# EAGLE schematic Shruthi-Digital-XT-v01 (EAGLE 5.09)

## Sheet 1 of 3
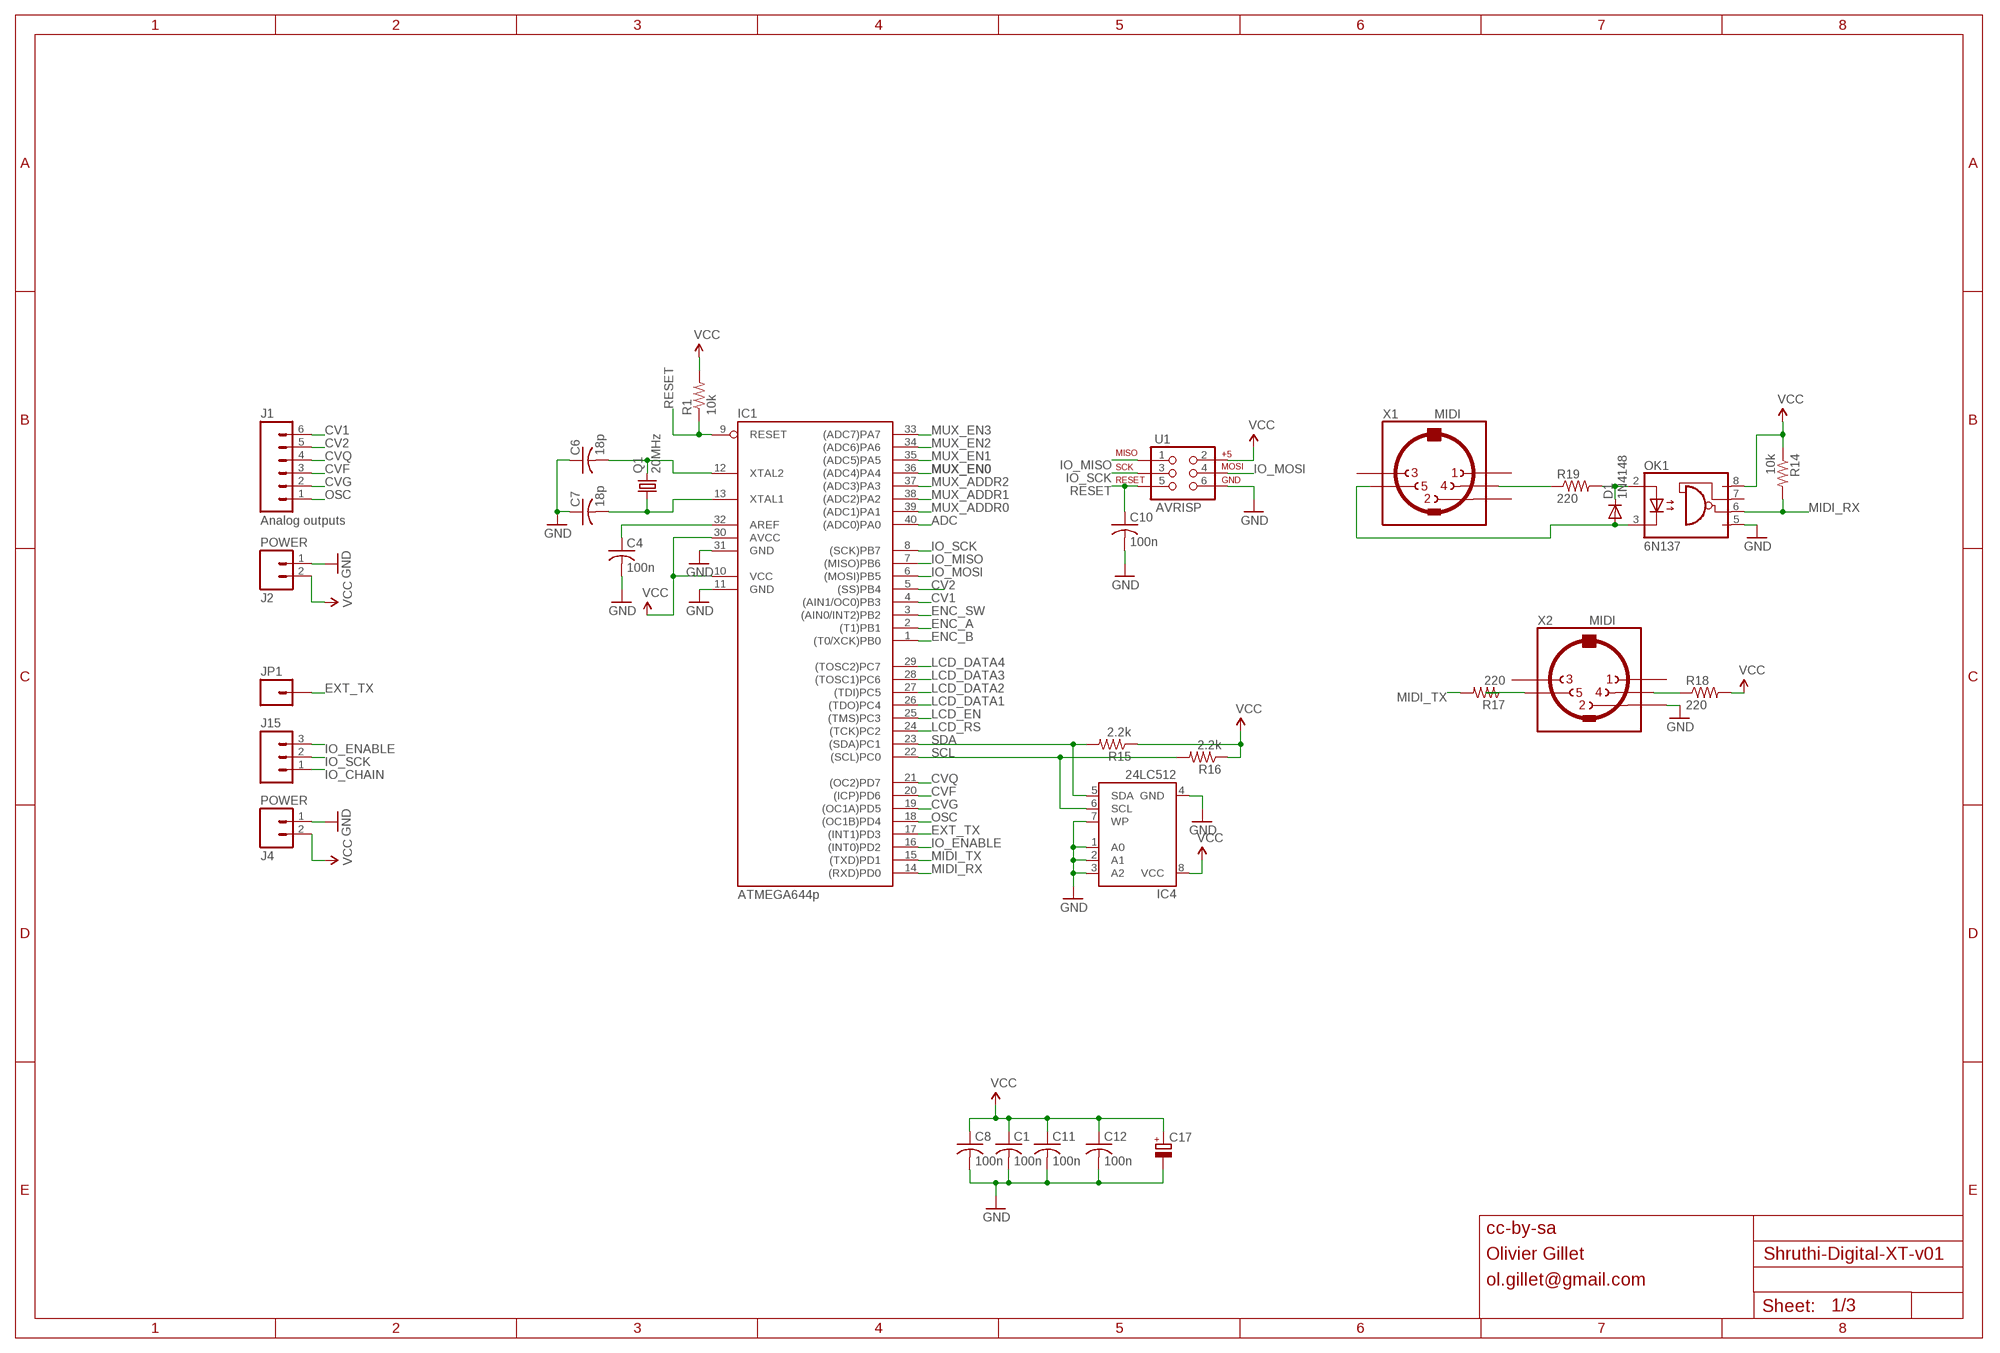
[diagram p0: schematic, sheet 1]

### Parts
C1  100n  C-US025-024X044  [C025-024X044]
C4  100n  C-US025-024X044  [C025-024X044]
C6  18p  C-US025-024X044  [C025-024X044]
C7  18p  C-US025-024X044  [C025-024X044]
C8  100n  C-US025-024X044  [C025-024X044]
C10  100n  C-US025-024X044  [C025-024X044]
C11  100n  C-US025-024X044  [C025-024X044]
C12  100n  C-US025-024X044  [C025-024X044]
C17  CPOL-EUE2.5-7  [E2,5-7]
D1  1N4148  DIODE-D-5  [D-5]
IC1  ATMEGA644p  MEGA16-P  [DIL40]
IC4  24LC512  AT24CP  [DIL08]
J1  M06SIP  [1X06]
J2  POWER  M02PTH  [1X02]
J4  POWER  M02PTH  [1X02]
J15  M03PTH  [1X03]
JP1  M01PTH  [1X01]
OK1  6N137  [DIL08]
Q1  20MHz  CRYSTALHC49U-V  [HC49U-V]
R1  10k  R-US_0204/7  [0204/7]
R14  10k  R-US_0204/7  [0204/7]
R15  2.2k  R-US_0204/7  [0204/7]
R16  2.2k  R-US_0204/7  [0204/7]
R17  220  R-US_0204/7  [0204/7]
R18  220  R-US_0204/7  [0204/7]
R19  220  R-US_0204/7  [0204/7]
U1  AVRISP  AVR_SPI_PRG_6PTH  [2X3]
X1  MIDI  MAB5SH  [MAB5SH]
X2  MIDI  MAB5SH  [MAB5SH]

### Nets
ADC: IC1.40((ADC0)PA0) ; also sheet 2
CV1: IC1.4((AIN1/OC0)PB3) J1.6
CV2: IC1.5((SS)PB4) J1.5
CVF: IC1.20((ICP)PD6) J1.3
CVG: IC1.19((OC1A)PD5) J1.2
CVQ: IC1.21((OC2)PD7) J1.4
ENC_A: IC1.2((T1)PB1) ; also sheet 3
ENC_B: IC1.1((T0/XCK)PB0) ; also sheet 3
ENC_SW: IC1.3((AIN0/INT2)PB2) ; also sheet 3
EXT_TX: IC1.17((INT1)PD3) JP1.1
GND: C1.2 C4.2 C6.1 C7.1 C8.2 C10.2 C11.2 C12.2 C17.- IC1.11(GND) IC1.31(GND) IC4.1(A0) IC4.2(A1) IC4.3(A2) IC4.4(GND) IC4.7(WP) J2.1 J4.1 OK1.5(GND) U1.6 X2.2 ; also sheet 2,3
IO_CHAIN: J15.1 ; also sheet 3
IO_ENABLE: IC1.16((INT0)PD2) J15.3 ; also sheet 3
IO_MISO: IC1.7((MISO)PB6) U1.1 ; also sheet 3
IO_MOSI: IC1.6((MOSI)PB5) U1.4 ; also sheet 3
IO_SCK: IC1.8((SCK)PB7) J15.2 U1.3 ; also sheet 3
LCD_DATA1: IC1.26((TDO)PC4) ; also sheet 3
LCD_DATA2: IC1.27((TDI)PC5) ; also sheet 3
LCD_DATA3: IC1.28((TOSC1)PC6) ; also sheet 3
LCD_DATA4: IC1.29((TOSC2)PC7) ; also sheet 3
LCD_EN: IC1.25((TMS)PC3) ; also sheet 3
LCD_RS: IC1.24((TCK)PC2) ; also sheet 3
MIDI_RX: IC1.14((RXD)PD0) OK1.6(VO) R14.2
MIDI_TX: IC1.15((TXD)PD1) R17.2
MUX_ADDR0: IC1.39((ADC1)PA1) ; also sheet 2
MUX_ADDR1: IC1.38((ADC2)PA2) ; also sheet 2
MUX_ADDR2: IC1.37((ADC3)PA3) ; also sheet 2
MUX_EN0: IC1.36((ADC4)PA4) ; also sheet 2
MUX_EN1: IC1.35((ADC5)PA5) ; also sheet 2
MUX_EN2: IC1.34((ADC6)PA6) ; also sheet 2
MUX_EN3: IC1.33((ADC7)PA7) ; also sheet 2
N$2: R17.1 X2.5
N$7: C4.1 IC1.32(AREF)
N$28: D1.C OK1.2(A) R19.2
N$68: R18.1 X2.4
N$72: R19.1 X1.4
N$73: D1.A OK1.3(C) X1.5
N$82: C7.2 IC1.13(XTAL1) Q1.1
N$83: C6.2 IC1.12(XTAL2) Q1.2
OSC: IC1.18((OC1B)PD4) J1.1
RESET: C10.1 IC1.9(RESET) R1.1 U1.5
SCL: IC1.22((SCL)PC0) IC4.6(SCL) R16.2
SDA: IC1.23((SDA)PC1) IC4.5(SDA) R15.2
VCC: C1.1 C8.1 C11.1 C12.1 C17.+ IC1.10(VCC) IC1.30(AVCC) IC4.8(VCC) J2.2 J4.2 OK1.8(VCC) R1.2 R14.1 R15.1 R16.1 R18.2 U1.2 ; also sheet 2,3
Unconnected: OK1.7(VE) X1.1 X1.2 X1.3 X2.1 X2.3

### Notes on the sheet
- Analog outputs
- cc-by-sa
- Olivier Gillet
- ol.gillet@gmail.com

## Sheet 2 of 3
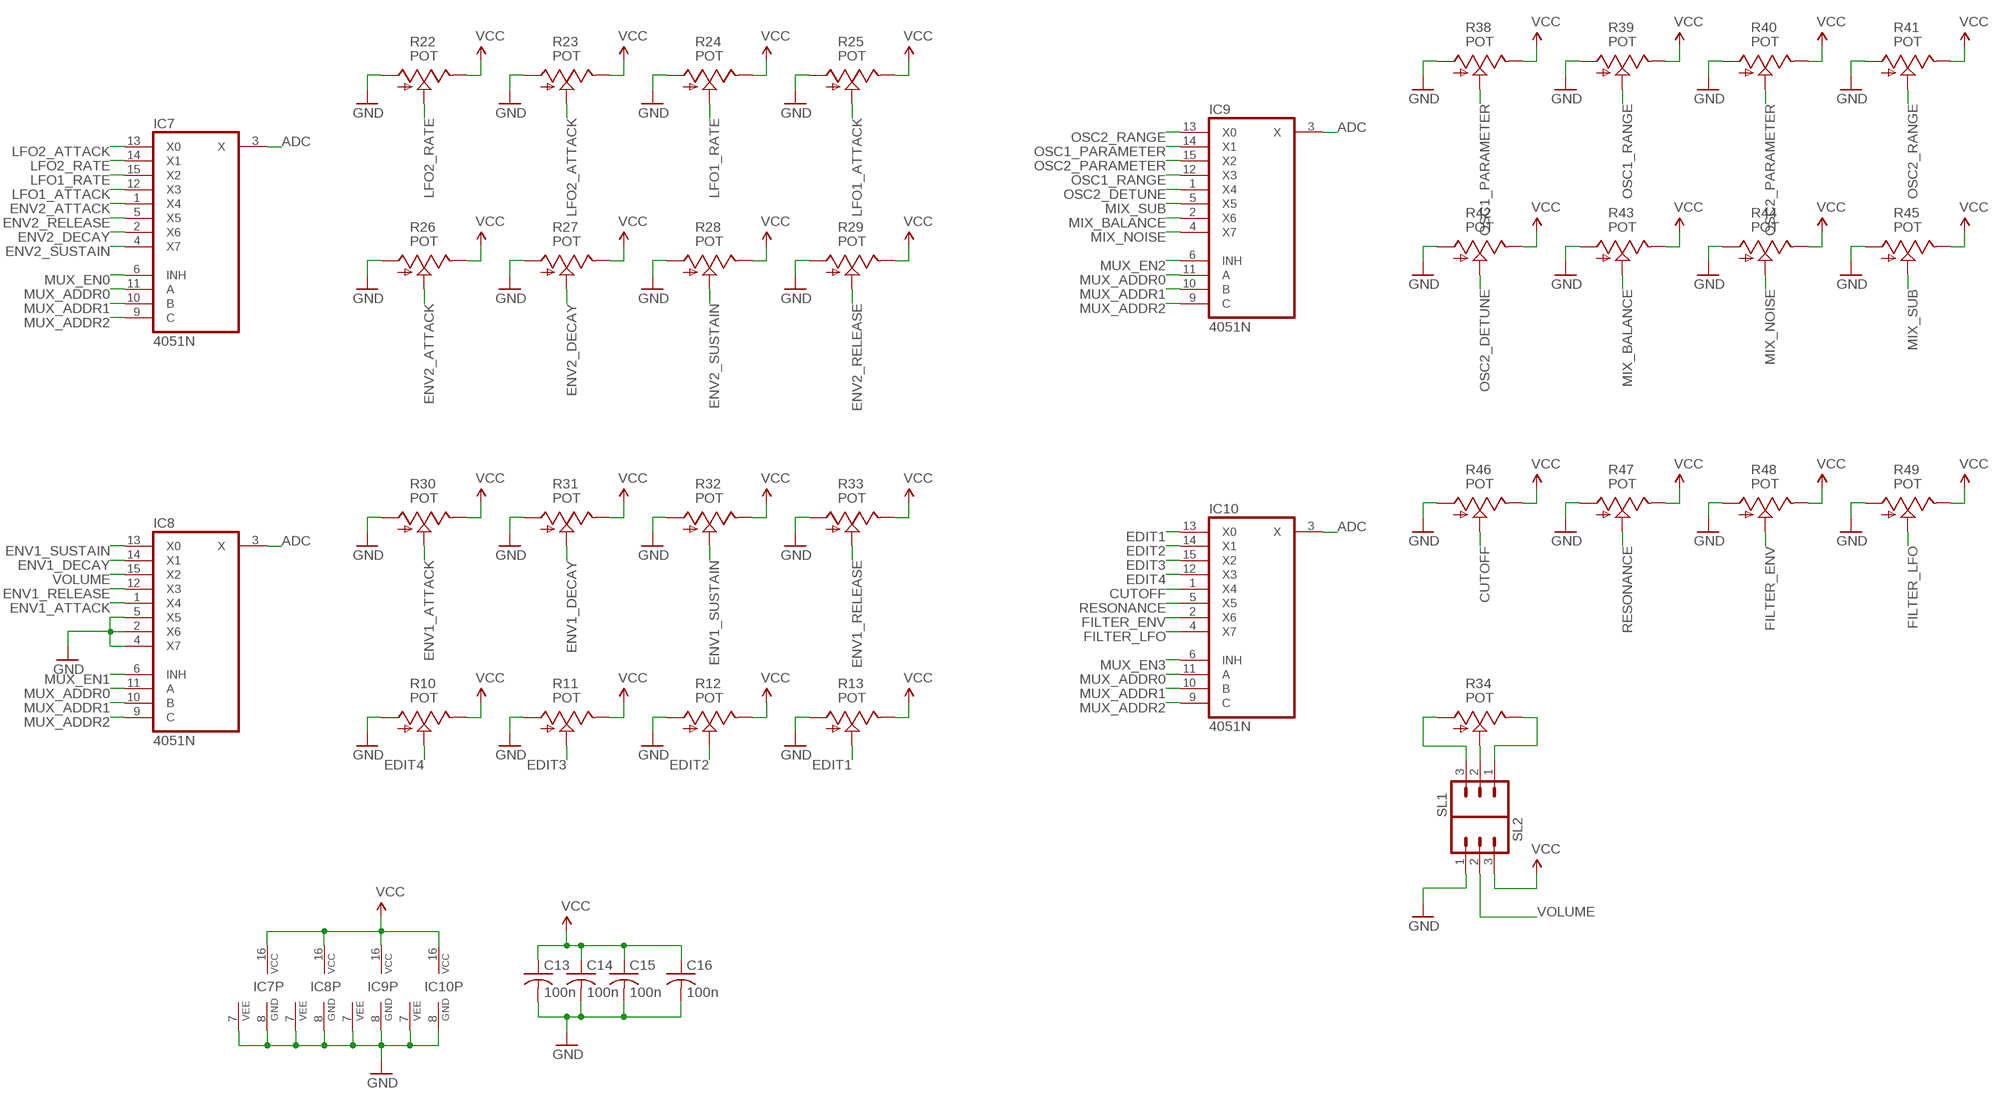
[diagram p1: schematic, sheet 2]

### Parts
C13  100n  C-US025-024X044  [C025-024X044]
C14  100n  C-US025-024X044  [C025-024X044]
C15  100n  C-US025-024X044  [C025-024X044]
C16  100n  C-US025-024X044  [C025-024X044]
IC7  4051N  [DIL16]
IC8  4051N  [DIL16]
IC9  4051N  [DIL16]
IC10  4051N  [DIL16]
R10  POT  POT_USVERTICAL  [ALPS_POT_VERTICAL]
R11  POT  POT_USVERTICAL  [ALPS_POT_VERTICAL]
R12  POT  POT_USVERTICAL  [ALPS_POT_VERTICAL]
R13  POT  POT_USVERTICAL  [ALPS_POT_VERTICAL]
R22  POT  POT_USVERTICAL  [ALPS_POT_VERTICAL]
R23  POT  POT_USVERTICAL  [ALPS_POT_VERTICAL]
R24  POT  POT_USVERTICAL  [ALPS_POT_VERTICAL]
R25  POT  POT_USVERTICAL  [ALPS_POT_VERTICAL]
R26  POT  POT_USVERTICAL  [ALPS_POT_VERTICAL]
R27  POT  POT_USVERTICAL  [ALPS_POT_VERTICAL]
R28  POT  POT_USVERTICAL  [ALPS_POT_VERTICAL]
R29  POT  POT_USVERTICAL  [ALPS_POT_VERTICAL]
R30  POT  POT_USVERTICAL  [ALPS_POT_VERTICAL]
R31  POT  POT_USVERTICAL  [ALPS_POT_VERTICAL]
R32  POT  POT_USVERTICAL  [ALPS_POT_VERTICAL]
R33  POT  POT_USVERTICAL  [ALPS_POT_VERTICAL]
R34  POT  POT_USVERTICAL  [ALPS_POT_VERTICAL]
R38  POT  POT_USVERTICAL  [ALPS_POT_VERTICAL]
R39  POT  POT_USVERTICAL  [ALPS_POT_VERTICAL]
R40  POT  POT_USVERTICAL  [ALPS_POT_VERTICAL]
R41  POT  POT_USVERTICAL  [ALPS_POT_VERTICAL]
R42  POT  POT_USVERTICAL  [ALPS_POT_VERTICAL]
R43  POT  POT_USVERTICAL  [ALPS_POT_VERTICAL]
R44  POT  POT_USVERTICAL  [ALPS_POT_VERTICAL]
R45  POT  POT_USVERTICAL  [ALPS_POT_VERTICAL]
R46  POT  POT_USVERTICAL  [ALPS_POT_VERTICAL]
R47  POT  POT_USVERTICAL  [ALPS_POT_VERTICAL]
R48  POT  POT_USVERTICAL  [ALPS_POT_VERTICAL]
R49  POT  POT_USVERTICAL  [ALPS_POT_VERTICAL]
SL1  M03PTH  [1X03]
SL2  M03PTH  [1X03]

### Nets
ADC: IC7.3(X) IC8.3(X) IC9.3(X) IC10.3(X) ; also sheet 1
CUTOFF: IC10.1(X4) R46.P$2(S)
EDIT1: IC10.13(X0) R13.P$2(S)
EDIT2: IC10.14(X1) R12.P$2(S)
EDIT3: IC10.15(X2) R11.P$2(S)
EDIT4: IC10.12(X3) R10.P$2(S)
ENV1_ATTACK: IC8.1(X4) R30.P$2(S)
ENV1_DECAY: IC8.14(X1) R31.P$2(S)
ENV1_RELEASE: IC8.12(X3) R33.P$2(S)
ENV1_SUSTAIN: IC8.13(X0) R32.P$2(S)
ENV2_ATTACK: IC7.1(X4) R26.P$2(S)
ENV2_DECAY: IC7.2(X6) R27.P$2(S)
ENV2_RELEASE: IC7.5(X5) R29.P$2(S)
ENV2_SUSTAIN: IC7.4(X7) R28.P$2(S)
FILTER_ENV: IC10.2(X6) R48.P$2(S)
FILTER_LFO: IC10.4(X7) R49.P$2(S)
GND: C13.2 C14.2 C15.2 C16.2 IC7.7(VEE) IC7.8(GND) IC8.2(X6) IC8.4(X7) IC8.5(X5) IC8.7(VEE) IC8.8(GND) IC9.7(VEE) IC9.8(GND) IC10.7(VEE) IC10.8(GND) R10.P$3(A) R11.P$3(A) R12.P$3(A) R13.P$3(A) R22.P$3(A) R23.P$3(A) R24.P$3(A) R25.P$3(A) R26.P$3(A) R27.P$3(A) R28.P$3(A) R29.P$3(A) R30.P$3(A) R31.P$3(A) R32.P$3(A) R33.P$3(A) R38.P$3(A) R39.P$3(A) R40.P$3(A) R41.P$3(A) R42.P$3(A) R43.P$3(A) R44.P$3(A) R45.P$3(A) R46.P$3(A) R47.P$3(A) R48.P$3(A) R49.P$3(A) SL2.1 ; also sheet 1,3
LFO1_ATTACK: IC7.12(X3) R25.P$2(S)
LFO1_RATE: IC7.15(X2) R24.P$2(S)
LFO2_ATTACK: IC7.13(X0) R23.P$2(S)
LFO2_RATE: IC7.14(X1) R22.P$2(S)
MIX_BALANCE: IC9.2(X6) R43.P$2(S)
MIX_NOISE: IC9.4(X7) R44.P$2(S)
MIX_SUB: IC9.5(X5) R45.P$2(S)
MUX_ADDR0: IC7.11(A) IC8.11(A) IC9.11(A) IC10.11(A) ; also sheet 1
MUX_ADDR1: IC7.10(B) IC8.10(B) IC9.10(B) IC10.10(B) ; also sheet 1
MUX_ADDR2: IC7.9(C) IC8.9(C) IC9.9(C) IC10.9(C) ; also sheet 1
MUX_EN0: IC7.6(INH) ; also sheet 1
MUX_EN1: IC8.6(INH) ; also sheet 1
MUX_EN2: IC9.6(INH) ; also sheet 1
MUX_EN3: IC10.6(INH) ; also sheet 1
N$6: R34.P$3(A) SL1.3
N$8: R34.P$1(E) SL1.1
N$14: R34.P$2(S) SL1.2
OSC1_PARAMETER: IC9.14(X1) R38.P$2(S)
OSC1_RANGE: IC9.12(X3) R39.P$2(S)
OSC2_DETUNE: IC9.1(X4) R42.P$2(S)
OSC2_PARAMETER: IC9.15(X2) R40.P$2(S)
OSC2_RANGE: IC9.13(X0) R41.P$2(S)
RESONANCE: IC10.5(X5) R47.P$2(S)
VCC: C13.1 C14.1 C15.1 C16.1 IC7.16(VCC) IC8.16(VCC) IC9.16(VCC) IC10.16(VCC) R10.P$1(E) R11.P$1(E) R12.P$1(E) R13.P$1(E) R22.P$1(E) R23.P$1(E) R24.P$1(E) R25.P$1(E) R26.P$1(E) R27.P$1(E) R28.P$1(E) R29.P$1(E) R30.P$1(E) R31.P$1(E) R32.P$1(E) R33.P$1(E) R38.P$1(E) R39.P$1(E) R40.P$1(E) R41.P$1(E) R42.P$1(E) R43.P$1(E) R44.P$1(E) R45.P$1(E) R46.P$1(E) R47.P$1(E) R48.P$1(E) R49.P$1(E) SL2.3 ; also sheet 1,3
VOLUME: IC8.15(X2) SL2.2

## Sheet 3 of 3
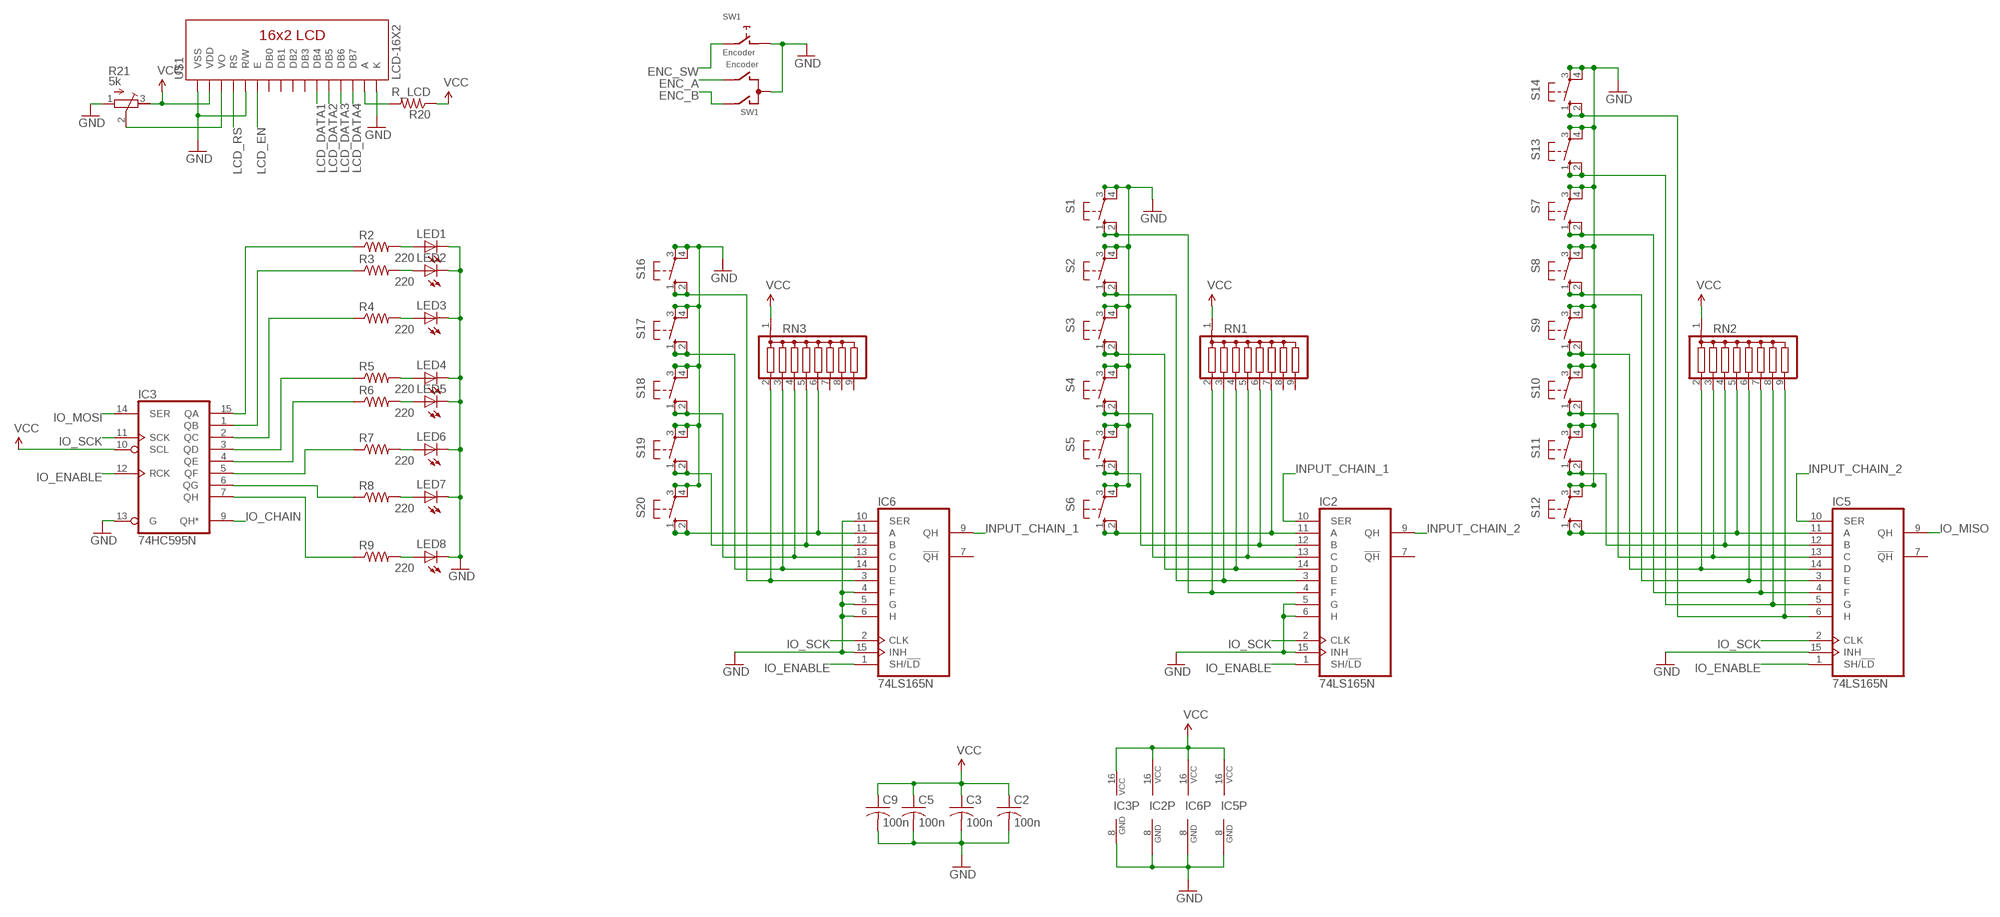
[diagram p2: schematic, sheet 3]

### Parts
C2  100n  C-US025-024X044  [C025-024X044]
C3  100n  C-US025-024X044  [C025-024X044]
C5  100n  C-US025-024X044  [C025-024X044]
C9  100n  C-US025-024X044  [C025-024X044]
IC2  74LS165N  [DIL16]
IC3  74HC595N  [DIL16]
IC5  74LS165N  [DIL16]
IC6  74LS165N  [DIL16]
LED1  LED3MM  [LED3MM]
LED2  LED3MM  [LED3MM]
LED3  LED3MM  [LED3MM]
LED4  LED3MM  [LED3MM]
LED5  LED3MM  [LED3MM]
LED6  LED3MM  [LED3MM]
LED7  LED3MM  [LED3MM]
LED8  LED3MM  [LED3MM]
R2  220  R-US_0204/7  [0204/7]
R3  220  R-US_0204/7  [0204/7]
R4  220  R-US_0204/7  [0204/7]
R5  220  R-US_0204/7  [0204/7]
R6  220  R-US_0204/7  [0204/7]
R7  220  R-US_0204/7  [0204/7]
R8  220  R-US_0204/7  [0204/7]
R9  220  R-US_0204/7  [0204/7]
R20  R_LCD  R-US_0204/7  [0204/7]
R21  5k  R-TRIMM3339P  [RTRIM3339P]
RN1  G08R  [SIL9]
RN2  G08R  [SIL9]
RN3  G08R  [SIL9]
S1  40-XX  [B3F-40XX]
S2  40-XX  [B3F-40XX]
S3  40-XX  [B3F-40XX]
S4  40-XX  [B3F-40XX]
S5  40-XX  [B3F-40XX]
S6  40-XX  [B3F-40XX]
S7  40-XX  [B3F-40XX]
S8  40-XX  [B3F-40XX]
S9  40-XX  [B3F-40XX]
S10  40-XX  [B3F-40XX]
S11  40-XX  [B3F-40XX]
S12  40-XX  [B3F-40XX]
S13  40-XX  [B3F-40XX]
S14  40-XX  [B3F-40XX]
S16  40-XX  [B3F-40XX]
S17  40-XX  [B3F-40XX]
S18  40-XX  [B3F-40XX]
S19  40-XX  [B3F-40XX]
S20  40-XX  [B3F-40XX]
SW1  Encoder  EC12E_SW  [ALPS_EC12E_SW]
U$1  LCD-16X2  [LCD-16X2]

### Nets
ENC_A: SW1.B ; also sheet 1
ENC_B: SW1.A ; also sheet 1
ENC_SW: SW1.E ; also sheet 1
GND: C2.2 C3.2 C5.2 C9.2 IC2.5(G) IC2.6(H) IC2.8(GND) IC2.15(INH) IC3.8(GND) IC3.13(G) IC5.8(GND) IC5.15(INH) IC6.4(F) IC6.5(G) IC6.6(H) IC6.8(GND) IC6.10(SER) IC6.15(INH) LED1.K(C) LED2.K(C) LED3.K(C) LED4.K(C) LED5.K(C) LED6.K(C) LED7.K(C) LED8.K(C) R21.1(E) S1.3(P) S1.4(P1) S2.3(P) S2.4(P1) S3.3(P) S3.4(P1) S4.3(P) S4.4(P1) S5.3(P) S5.4(P1) S6.3(P) S6.4(P1) S7.3(P) S7.4(P1) S8.3(P) S8.4(P1) S9.3(P) S9.4(P1) S10.3(P) S10.4(P1) S11.3(P) S11.4(P1) S12.3(P) S12.4(P1) S13.3(P) S13.4(P1) S14.3(P) S14.4(P1) S16.3(P) S16.4(P1) S17.3(P) S17.4(P1) S18.3(P) S18.4(P1) S19.3(P) S19.4(P1) S20.3(P) S20.4(P1) SW1.C SW1.D U$1.1(VSS) U$1.5(R/W) U$1.16(K) ; also sheet 1,2
INPUT_CHAIN_1: IC2.10(SER) IC6.9(QH)
INPUT_CHAIN_2: IC2.9(QH) IC5.10(SER)
IO_CHAIN: IC3.9(QH*) ; also sheet 1
IO_ENABLE: IC2.1(SH/!LD) IC3.12(RCK) IC5.1(SH/!LD) IC6.1(SH/!LD) ; also sheet 1
IO_MISO: IC5.9(QH) ; also sheet 1
IO_MOSI: IC3.14(SER) ; also sheet 1
IO_SCK: IC2.2(CLK) IC3.11(SCK) IC5.2(CLK) IC6.2(CLK) ; also sheet 1
LCD_DATA1: U$1.11(DB4) ; also sheet 1
LCD_DATA2: U$1.12(DB5) ; also sheet 1
LCD_DATA3: U$1.13(DB6) ; also sheet 1
LCD_DATA4: U$1.14(DB7) ; also sheet 1
LCD_EN: U$1.6(E) ; also sheet 1
LCD_RS: U$1.4(RS) ; also sheet 1
N$1: IC3.2(QC) R4.1
N$3: IC2.11(A) RN1.7 S6.1(S) S6.2(S1)
N$5: IC2.3(E) RN1.3 S2.1(S) S2.2(S1)
N$9: IC5.4(F) RN2.7 S7.1(S) S7.2(S1)
N$10: IC5.14(D) RN2.2 S9.1(S) S9.2(S1)
N$11: IC5.13(C) RN2.3 S10.1(S) S10.2(S1)
N$12: IC5.12(B) RN2.4 S11.1(S) S11.2(S1)
N$13: IC5.11(A) RN2.5 S12.1(S) S12.2(S1)
N$15: IC5.3(E) RN2.6 S8.1(S) S8.2(S1)
N$17: IC5.5(G) RN2.8 S13.1(S) S13.2(S1)
N$24: IC5.6(H) RN2.9 S14.1(S) S14.2(S1)
N$30: IC3.15(QA) R2.1
N$31: IC3.1(QB) R3.1
N$33: IC3.3(QD) R5.1
N$34: IC3.4(QE) R6.1
N$35: IC3.5(QF) R7.1
N$36: IC3.7(QH) R9.1
N$37: IC3.6(QG) R8.1
N$38: IC6.14(D) RN3.3 S17.1(S) S17.2(S1)
N$39: IC6.13(C) RN3.4 S18.1(S) S18.2(S1)
N$40: IC6.12(B) RN3.5 S19.1(S) S19.2(S1)
N$41: IC6.11(A) RN3.6 S20.1(S) S20.2(S1)
N$42: LED1.A R2.2
N$43: LED2.A R3.2
N$44: LED3.A R4.2
N$45: LED4.A R5.2
N$46: LED5.A R6.2
N$47: LED6.A R7.2
N$48: LED7.A R8.2
N$49: LED8.A R9.2
N$50: IC6.3(E) RN3.2 S16.1(S) S16.2(S1)
N$59: IC2.4(F) RN1.2 S1.1(S) S1.2(S1)
N$61: IC2.14(D) RN1.4 S3.1(S) S3.2(S1)
N$62: IC2.13(C) RN1.5 S4.1(S) S4.2(S1)
N$63: IC2.12(B) RN1.6 S5.1(S) S5.2(S1)
N$78: R21.2(S) U$1.3(VO)
N$79: R20.2 U$1.15(A)
VCC: C2.1 C3.1 C5.1 C9.1 IC2.16(VCC) IC3.10(SCL) IC3.16(VCC) IC5.16(VCC) IC6.16(VCC) R20.1 R21.3(A) RN1.1 RN2.1 RN3.1 U$1.2(VDD) ; also sheet 1,2
Unconnected: IC2.7(!QH) IC5.7(!QH) IC6.7(!QH) RN1.8 RN1.9 RN3.7 RN3.8 RN3.9 SW1.GND1(G) SW1.GND2(G) U$1.7(DB0) U$1.8(DB1) U$1.9(DB2) U$1.10(DB3)

## Library data of the parts
C1-C16 = rcl:C-US: CAPACITOR, American symbol
C17 = rcl:CPOL-EU: POLARIZED CAPACITOR, European symbol
D1 = diode:DIODE-: DIODE
IC1 = atmel:MEGA16-P: MICROCONTROLLER 16 Kbytes FLASH 1 kbytes SRAM 512 bytes EEPROM USART 8-channel 10 bit ADC Source: avr.lbr
IC2 IC5 IC6 = 74xx-us:74*165: 8-bit parallel load SHIFT REGISTER
IC3 = 74xx-eu:74*595: 8-bit SHIFT REGISTER, output latch
IC4 = atmel:AT24C*: 2-wire serial EEPROM
IC7-IC10 = 40xx:4051: 8-channel ANALOG MULTIPLEXER
J1 = SparkFun:M06: Header 6 Standard 6-pin 0.1" header. Use with straight break away headers (SKU : PRT-00116), right angle break away headers (PRT-00553), swiss pins (PRT-00743), machine pins (PRT-00117), and female headers (PRT-00115). Molex polarized connector foot print use with SKU : PRT-08094 with associated crimp pins and housings. NOTES ON THE VARIANTS LOCK and LOCK_LONGPADS... This footprint was designed to help hold the alignment of a through-hole component (i.e. 6-pin header) while soldering it into place. You may notice that each hole has been shifted either up or down by 0.005 of an inch from it's more standard position (which is a perfectly straight line). This slight alteration caused the pins (the squares in the middle) to touch the edges of the holes. Because they are alternating, it causes a "brace" to hold the component in place. 0.005 has proven to be the perfect amount of "off-center" position when using our standard breakaway headers. Although looks a little odd when you look at the bare footprint, once you have a header in there, the alteration is very hard to notice. Also, if you push a header all the way into place, it is covered up entirely on the bottom side. This idea of altering the position of holes to aid alignment will be further integrated into the Sparkfun Library for other footprints. It can help hold any component with 3 or more connection pins.
J2 J4 = SparkFun:M02: Header 2 Standard 2-pin 0.1" header. Use with straight break away headers (SKU : PRT-00116), right angle break away headers (PRT-00553), swiss pins (PRT-00743), machine pins (PRT-00117), and female headers (PRT-00115). Molex polarized connector foot print use with SKU : PRT-08233 with associated crimp pins and housings.
J15 SL1 SL2 = SparkFun:M03: Header 3 Standard 3-pin 0.1" header. Use with straight break away headers (SKU : PRT-00116), right angle break away headers (PRT-00553), swiss pins (PRT-00743), machine pins (PRT-00117), and female headers (PRT-00115). Molex polarized connector foot print use with SKU : PRT-08232 with associated crimp pins and housings.
JP1 = SparkFun:M01: Header 1 Standard 1-pin 0.1" header. Use with straight break away headers (SKU : PRT-00116), right angle break away headers (PRT-00553), swiss pins (PRT-00743), machine pins (PRT-00117), and female headers (PRT-00115).
LED1-LED8 = led:LED: LED OSRAM: - CHIPLED LG R971, LG N971, LY N971, LG Q971, LY Q971, LO R971, LY R971 LH N974, LH R974 LS Q976, LO Q976, LY Q976 LO Q996 - Hyper CHIPLED LW Q18S LB Q993, LB Q99A, LB R99A - SideLED LS A670, LO A670, LY A670, LG A670, LP A670 LB A673, LV A673, LT A673, LW A673 LH A674 LY A675 LS A676, LA A676, LO A676, LY A676, LW A676 LS A679, LY A679, LG A679 - Hyper Micro SIDELED® LS Y876, LA Y876, LO Y876, LY Y876 LT Y87S - SmartLED LW L88C, LW L88S LB L89C, LB L89S, LG L890 LS L89K, LO L89K, LY L89K LS L896, LA L896, LO L896, LY L896 - TOPLED LS T670, LO T670, LY T670, LG T670, LP T670 LSG T670, LSP T670, LSY T670, LOP T670, LYG T670 LG T671, LOG T671, LSG T671 LB T673, LV T673, LT T673, LW T673 LH T674 LS T676, LA T676, LO T676, LY T676, LB T676, LH T676, LSB T676, LW T676 LB T67C, LV T67C, LT T67C, LS T67K, LO T67K, LY T67K, LW E67C LS E67B, LA E67B, LO E67B, LY E67B, LB E67C, LV E67C, LT E67C LW T67C LS T679, LY T679, LG T679 LS T770, LO T770, LY T770, LG T770, LP T770 LB T773, LV T773, LT T773, LW T773 LH T774 LS E675, LA E675, LY E675, LS T675 LS T776, LA T776, LO T776, LY T776, LB T776 LHGB T686 LT T68C, LB T68C - Hyper Mini TOPLED® LB M676 - Mini TOPLED Santana® LG M470 LS M47K, LO M47K, LY M47K Source: http://www.osram.convergy.de LUXEON: - LUMILED® LXK2-PW12-R00, LXK2-PW12-S00, LXK2-PW14-U00, LXK2-PW14-V00 LXK2-PM12-R00, LXK2-PM12-S00, LXK2-PM14-U00 LXK2-PE12-Q00, LXK2-PE12-R00, LXK2-PE12-S00, LXK2-PE14-T00, LXK2-PE14-U00 LXK2-PB12-K00, LXK2-PB12-L00, LXK2-PB12-M00, LXK2-PB14-N00, LXK2-PB14-P00, LXK2-PB14-Q00 LXK2-PR12-L00, LXK2-PR12-M00, LXK2-PR14-Q00, LXK2-PR14-R00 LXK2-PD12-Q00, LXK2-PD12-R00, LXK2-PD12-S00 LXK2-PH12-R00, LXK2-PH12-S00 LXK2-PL12-P00, LXK2-PL12-Q00, LXK2-PL12-R00 Source: www.luxeon.com KINGBRIGHT: KA-3528ASYC Source: www.kingbright.com
OK1 = optocoupler:6N137: MOTOROLA OPTO COUPLER
Q1 = crystal:CRYSTAL: CRYSTAL
R1-R9 R14-R20 = rcl:R-US_: RESISTOR, American symbol
R10-R13 R22-R34 R38-R49 = pot-alps:POT_US
R21 = rcl:R-TRIMM: Trimm resistor
RN1-RN3 = resistor-sil:G08R: SIL RESISTOR
S1-S14 S16-S20 = og-switch:40-XX: OMRON SWITCH
SW1 = switch-alps:EC12E_SW: ALPS rotary Encoder EC12E series with switch
U1 = SparkFun:AVR_SPI_PRG_6: AVR ISP 6 Pin This is the reduced ISP connector for AVR programming. Common on Arduino. This footprint will take up less PCB space and can be used with a 10-pin to 6-pin adapter such as SKU: BOB-08508
U$1 = SparkFun:LCD-16X2
X1 X2 = og-midi:MAB5SH: Female CONNECTOR 5 pins 90 deg. with shield, horizontal (DIN 41524)